# EasyEDA Pro project 2.eprj

# Schematic Schematic1
Create Date: 2024-03-25; Page Name: P1; Project Name: 2; Schematic Name: Schematic1; Update Date: 2024-03-25; Company: 嘉立创EDA; Page Size: A4; Version: V1.0
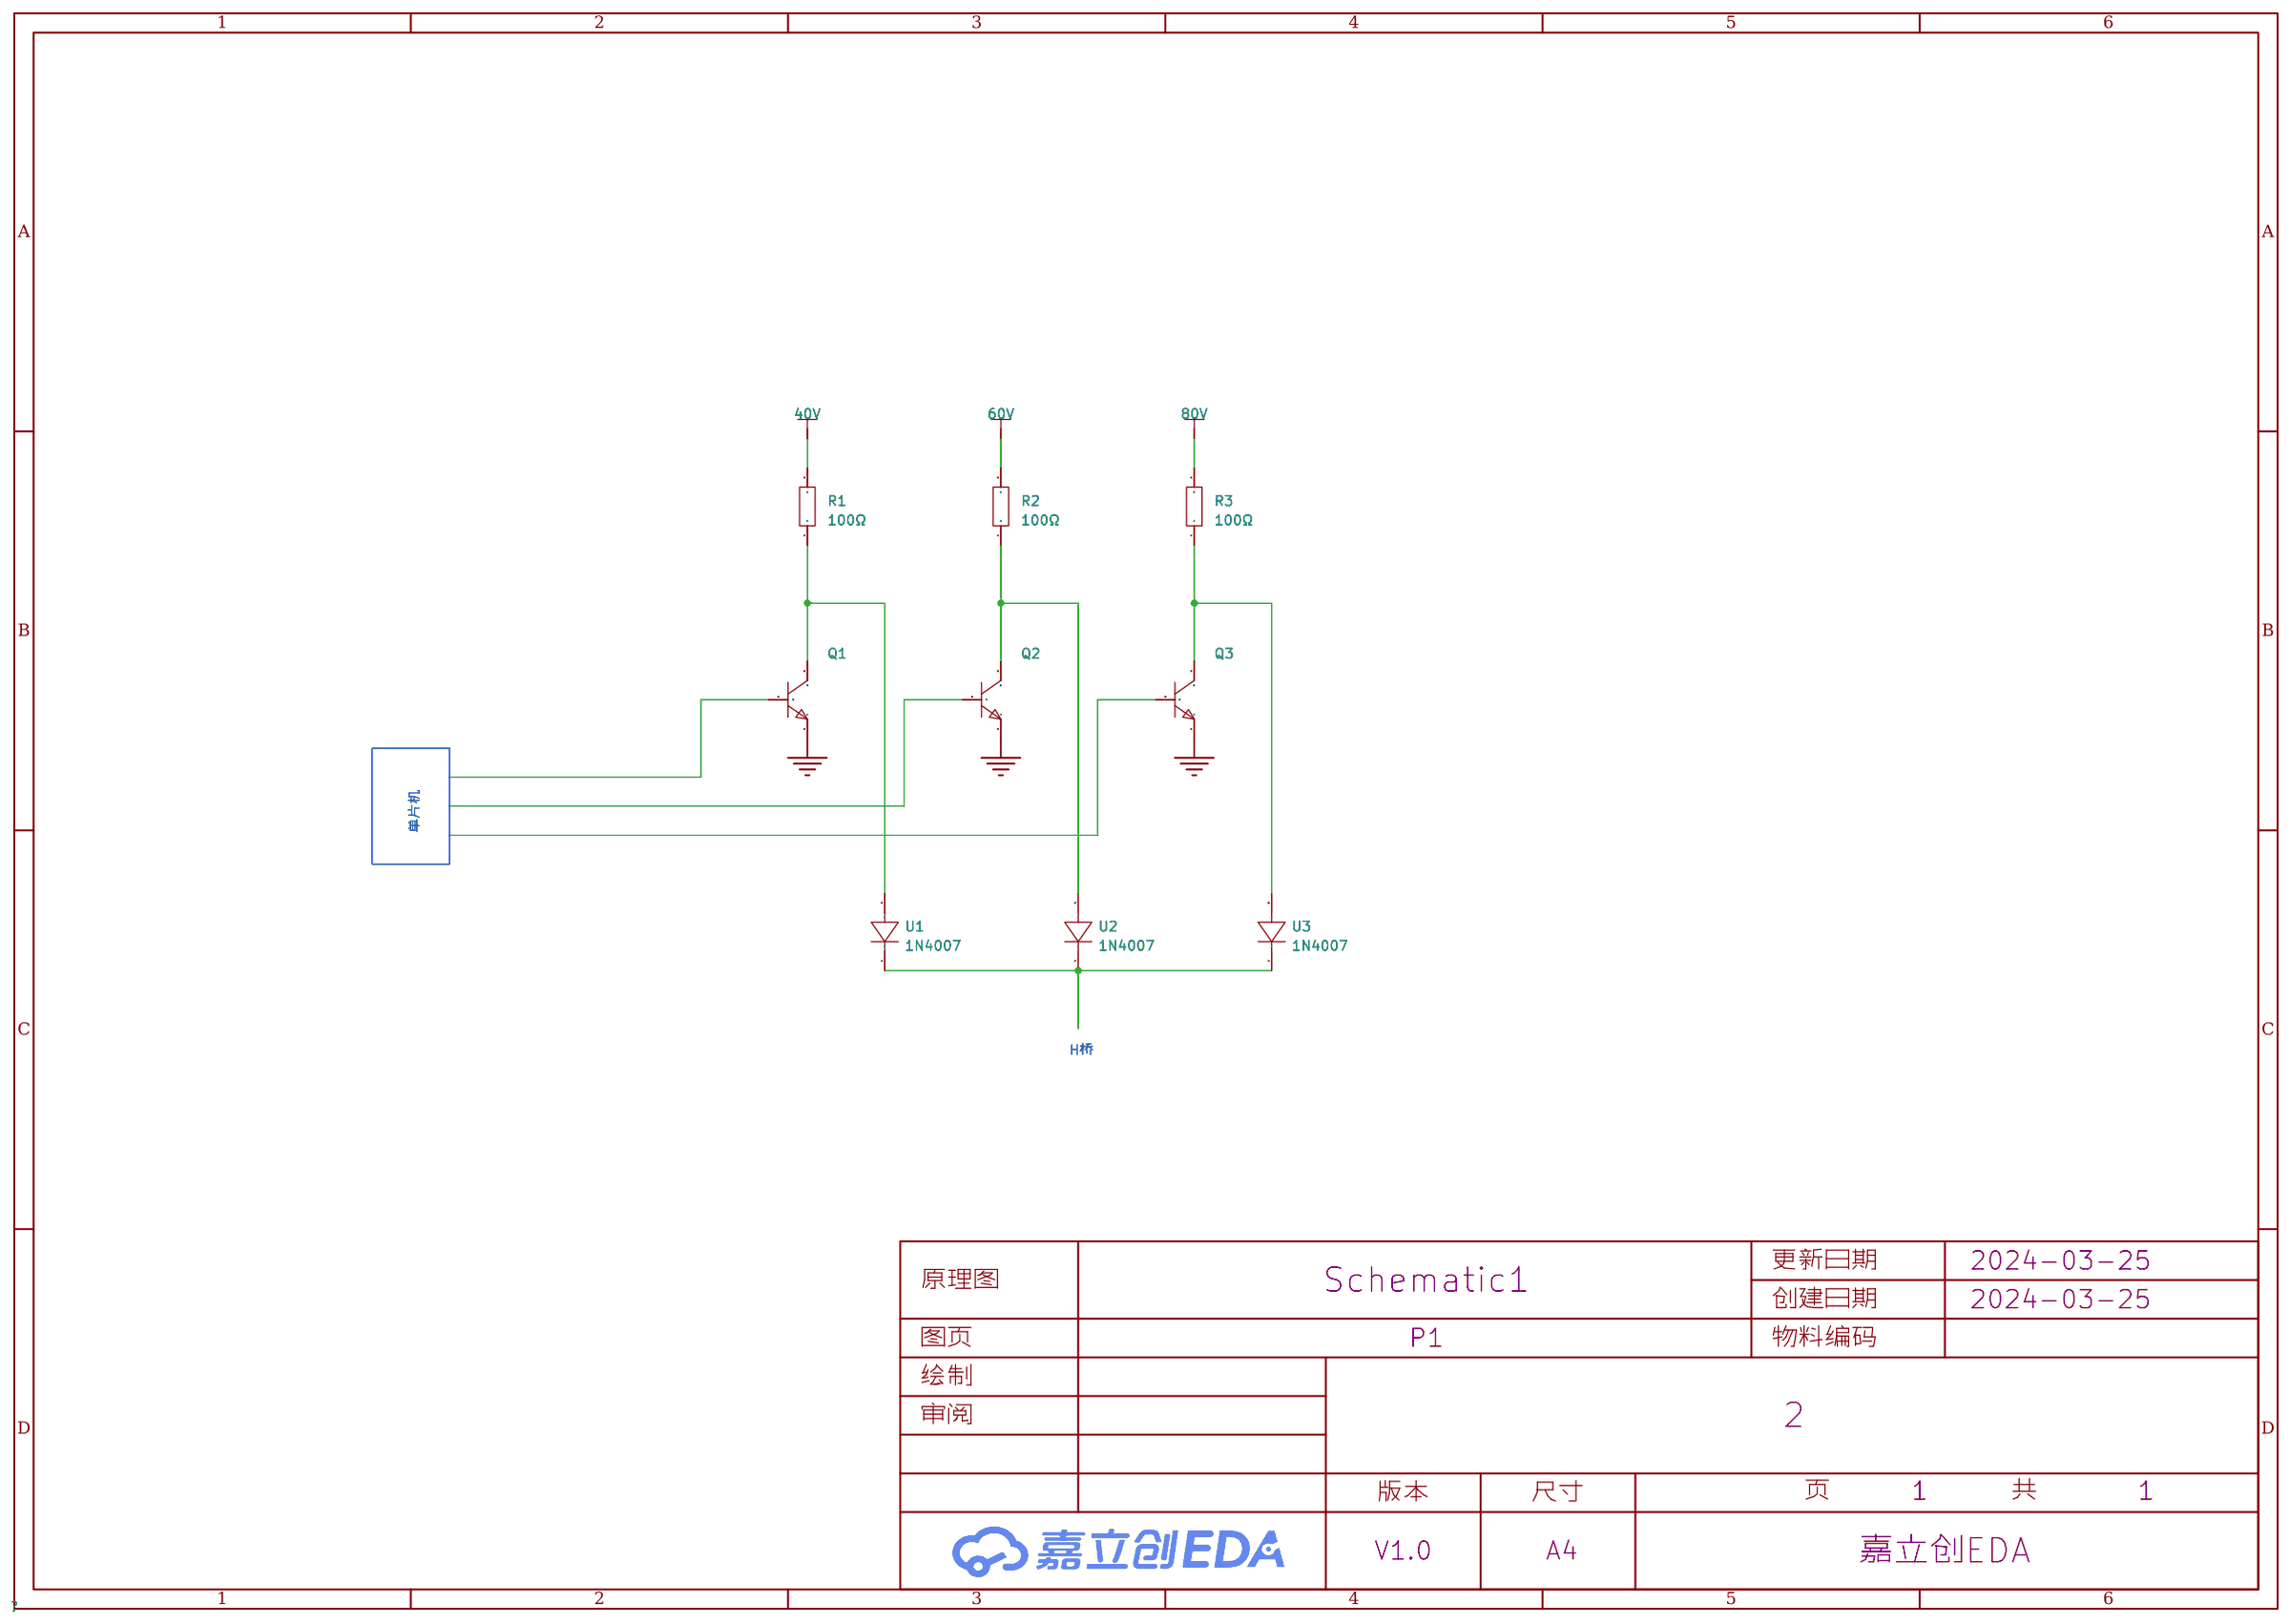
[diagram p0: schematic sheet]

## Parts
Q1  -  [S8050_TO_92]
Q2  -  [S8050_TO_92]
Q3  -  [S8050_TO_92]
R1  100Ω  [R0603]
R2  100Ω  [R0603]
R3  100Ω  [R0603]
U1  1N4007  [SMA_L4.3-W2.6-LS5.1-RD]
U2  1N4007  [SMA_L4.3-W2.6-LS5.1-RD]
U3  1N4007  [SMA_L4.3-W2.6-LS5.1-RD]

## Library data of the parts
Q1-Q3 = S8050_TO_NPN: Supplier Footprint: TO-92
R1-R3 = Res_0603: Supplier Footprint: 0603
U1-U3 = 1N4007: Supplier Part: C9900004759; JLCPCB Part Class: Extended Part; Supplier: LCSC

## Nets
40V: R1.2
60V: R2.2
80V: R3.2
GND: Q1.1(E) Q2.1(E) Q3.1(E)
Net-(Q1-3): Q1.3(C) R1.1 U1.2(A)
Net-(Q2-3): Q2.3(C) R2.1 U2.2(A)
Net-(Q3-3): Q3.3(C) R3.1 U3.2(A)
Net-(U1-1): U1.1(K) U2.1(K) U3.1(K)

Not connected (* = marked no-connect by the designer): Q1 2(B); Q2 2(B); Q3 2(B)

## Notes on the sheet
- 单片机
- H桥
